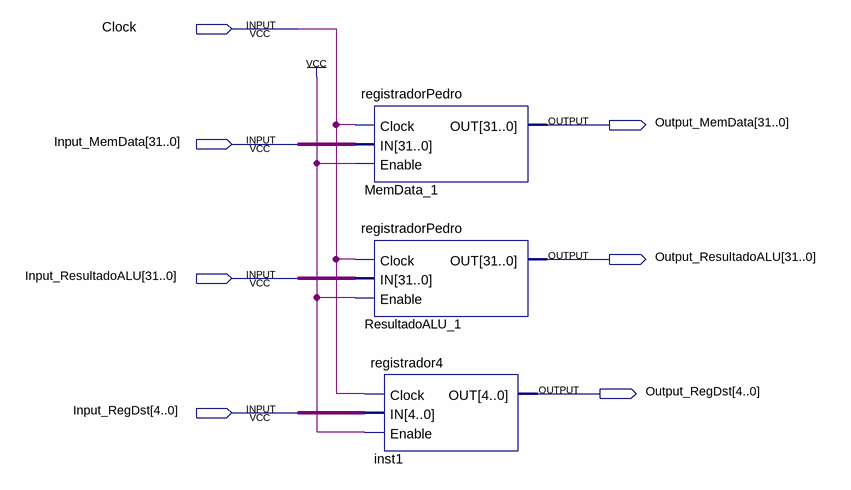
[diagram p0: schematic sheet]
// Quartus schematic barreira_MEM_WB.bdf as structural Verilog: 3 symbols, 7 pins
module barreira_MEM_WB (
  input  Clock,
  input  [31:0] Input_MemData,
  input  [31:0] Input_ResultadoALU,
  input  [4:0] Input_RegDst,
  output [31:0] Output_MemData,
  output [31:0] Output_ResultadoALU,
  output [4:0] Output_RegDst
);

  registradorPedro MemData_1 (.Clock(Clock), .IN(Input_MemData), .Enable(1'b1), .OUT(Output_MemData));
  registradorPedro ResultadoALU_1 (.Clock(Clock), .IN(Input_ResultadoALU), .Enable(1'b1), .OUT(Output_ResultadoALU));
  registrador4 inst1 (.Clock(Clock), .IN(Input_RegDst), .Enable(1'b1), .OUT(Output_RegDst));
endmodule
